# EAGLE design Humus_ethernet_dip_v4 (EAGLE 7.6.0)
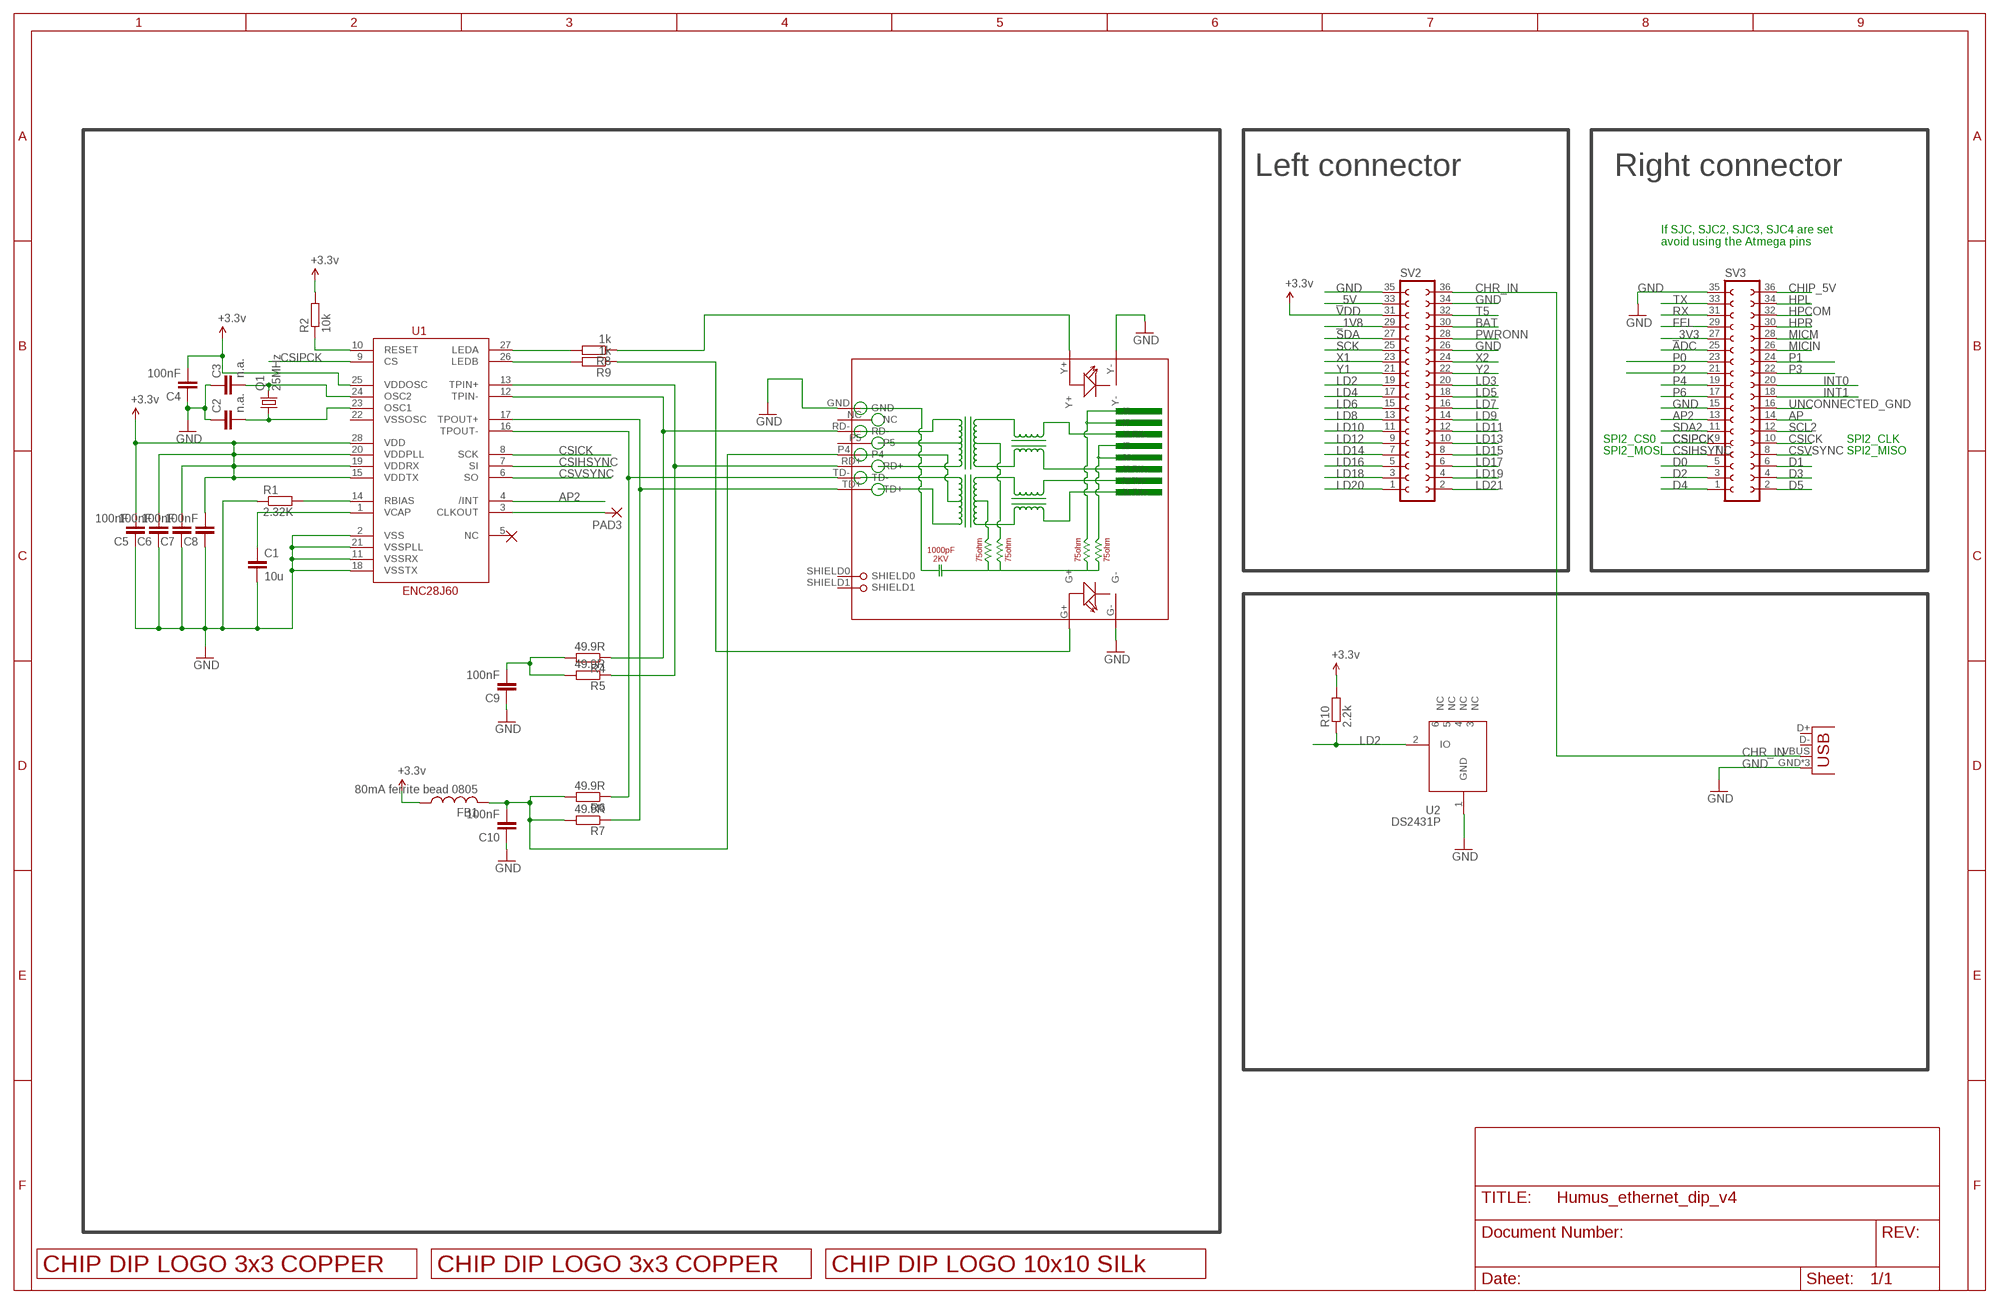
[diagram p0: schematic, sheet 1]

## Parts
C1  10u  C-EUC0805  [C0805]
C2  n.a.  C-EUC0805  [C0805]
C3  n.a.  C-EUC0805  [C0805]
C4  100nF  C-EUC0805  [C0805]
C5  100nF  C-EUC0805  [C0805]
C6  100nF  C-EUC0805  [C0805]
C7  100nF  C-EUC0805  [C0805]
C8  100nF  C-EUC0805  [C0805]
C9  100nF  C-EUC0805  [C0805]
C10  100nF  C-EUC0805  [C0805]
FB1  80mA ferrite bead 0805  FERRITE-BEADB  [0805]
PAD3  WIREPADSMD1,27-254  [SMD1,27-2,54]
Q1  25MHz  CRYSTALSM49  [SM49]
R1  2.32K  R-EU_R0805  [R0805]
R2  10k  R-EU_R0805  [R0805]
R4  49.9R  R-EU_R0805  [R0805]
R5  49.9R  R-EU_R0805  [R0805]
R6  49.9R  R-EU_R0805  [R0805]
R7  49.9R  R-EU_R0805  [R0805]
R8  1k  R-EU_R0805  [R0805]
R9  1k  R-EU_R0805  [R0805]
R10  2.2k  R-EU_R0805  [R0805]
RJ1  HR911105A  [HR911105A]
SV2  FE18-2  [FE18-2]
SV3  FE18-2  [FE18-2]
U1  ENC28J60SS  ENC28J60  [SSOP28DB]
U2  DS2431P  [TSOC6]
U$1  LOGO_10X10_SILK  [LOGO2_10X10_SILK]
U$2  LOGO_3X3_COPPER  [LOGO_3X3_COPPER]
U$4  LOGO_3X3_COPPER  [LOGO_3X3_COPPER]
USB  USBUSB-MICROB-SMT-DIP  [USB-MICROB-SMT-DIP]

## Nets
_1V8: SV2.29
_3V3: SV3.27
_5V: SV2.33
ADC: SV3.25
AP: SV3.14
AP2: SV3.13 U1.4(/INT)
BAT: SV2.30
CHIP_5V: SV3.36
CHR_IN: SV2.36 USB.VBUS
CSICK: SV3.10 U1.8(SCK)
CSIHSYNC: SV3.7 U1.7(SI)
CSIPCK: SV3.9 U1.9(CS)
CSVSYNC: SV3.8 U1.6(SO)
CT: C10.2 FB1.2 R6.2 R7.2 RJ1.P4
D0: SV3.5
D1: SV3.6
D2: SV3.3
D3: SV3.4
D4: SV3.1
D5: SV3.2
FEL: SV3.29
GND: C1.2 C2.1 C3.1 C4.1 C5.1 C6.1 C7.1 C8.1 C9.1 C10.1 R1.1 RJ1.G- RJ1.GND RJ1.Y- SV2.26 SV2.34 SV2.35 SV3.15 SV3.35 U1.2(VSS) U1.11(VSSRX) U1.18(VSSTX) U1.21(VSSPLL) U2.1(GND) USB.GND USB.MT1(GND) USB.MT2(GND)
HPCOM: SV3.32
HPL: SV3.34
HPR: SV3.30
INT0: SV3.20
INT1: SV3.18
LD2: R10.1 SV2.19 U2.2(IO)
LD3: SV2.20
LD4: SV2.17
LD5: SV2.18
LD6: SV2.15
LD7: SV2.16
LD8: SV2.13
LD9: SV2.14
LD10: SV2.11
LD11: SV2.12
LD12: SV2.9
LD13: SV2.10
LD14: SV2.7
LD15: SV2.8
LD16: SV2.5
LD17: SV2.6
LD18: SV2.3
LD19: SV2.4
LD20: SV2.1
LD21: SV2.2
MICIN: SV3.26
MICM: SV3.28
N$1: C1.1 U1.1(VCAP)
N$2: R2.1 U1.10(RESET)
N$3: R1.2 U1.14(RBIAS)
N$6: C3.2 Q1.2 U1.24(OSC2)
N$7: C2.2 Q1.1 U1.23(OSC1)
N$10: R8.1 RJ1.Y+
N$11: R9.1 RJ1.G+
N$13: PAD3.1(P) U1.3(CLKOUT)
N$14: C9.2 R4.2 R5.2
N$15: R8.2 U1.27(LEDA)
N$16: R9.2 U1.26(LEDB)
P0: SV3.23
P1: SV3.24
P2: SV3.21
P3: SV3.22
P4: SV3.19
P6: SV3.17
PWRONN: SV2.28
RD+: R5.1 RJ1.RD+ U1.13(TPIN+)
RD-: R4.1 RJ1.RD- U1.12(TPIN-)
RX: SV3.31
SCK: SV2.25
SCL2: SV3.12
SDA: SV2.27
SDA2: SV3.11
T5: SV2.32
TD+: R7.1 RJ1.TD+ U1.17(TPOUT+)
TD-: R6.1 RJ1.TD- U1.16(TPOUT-)
TX: SV3.33
UNCONNECTED_GND: SV3.16
VDD: C4.2 C5.2 C6.2 C7.2 C8.2 FB1.1 R2.2 R10.2 SV2.31 U1.15(VDDTX) U1.19(VDDRX) U1.20(VDDPLL) U1.25(VDDOSC) U1.28(VDD) ; supply symbol labelled +3.3v
X1: SV2.23
X2: SV2.24
Y1: SV2.21
Y2: SV2.22
Unconnected: RJ1.NC RJ1.P5 RJ1.SHIELD0 RJ1.SHIELD1 U1.5(NC) U1.22(VSSOSC) U2.3(NC) U2.4(NC) U2.5(NC) U2.6(NC) USB.D+ USB.D-

## Notes on the sheet
- Left connector | Right connector
- If SJC, SJC2, SJC3, SJC4 are set 
  avoid using the Atmega pins
- SPI2_CS0 | SPI2_CLK
- SPI2_MOSI | SPI2_MISO

## Library data of the parts
C1-C10 = rcl:C-EU: CAPACITOR, European symbol
FB1 = m-pad-2.1:FERRITE-BEAD: Ferrite beads in various packages
PAD3 = wirepad:WIREPAD: Wire PAD connect wire on PCB
Q1 = adafruit:CRYSTAL: CRYSTAL; OC_FARNELL: unknown; OC_NEWARK: unknown
R1 R2 R4-R10 = rcl:R-EU_: RESISTOR, European symbol
RJ1 = CONNECTER:HR911105A
SV2 SV3 = con-lsta:FE18-2: FEMALE HEADER; OC_FARNELL: unknown; OC_NEWARK: unknown
U1 = SparkFun-DigitalIC:ENC28J60: Microchip SPI 10Base ethernet IC
U2 = JKW_CHIP:DS2431: 1024-Bit EEPROM This chip provides a 4x256 Bit EEPROM, which can be programmed@5V. Write protection and OTP emulation are available, too. Author: Jan Kandziora <jjj@gmx.de>; DESCRIPTION: IC, 1024-Bit, 1-Wire EEPROM, TSOC6; FOOTPRINT: TSOC6; LINK: http://www.digikey.com/product-detail/en/DS2431P%2BT%26R/DS2431P%2BT%26RCT-ND/3647900; MFG: DIGIKEY; MFG_PN: DS2431P+T&RCT-ND; PART_TYPE: IC; PRICE: 0.98; VENDOR: MAXIM; VENDOR_PART_NUMBER: DS2431P+T&R
U$1 = JKW_CHIP:LOGO_10X10_SILK
U$2 U$4 = logo:LOGO_3X3_COPPER
USB = Spark:USB

## Board
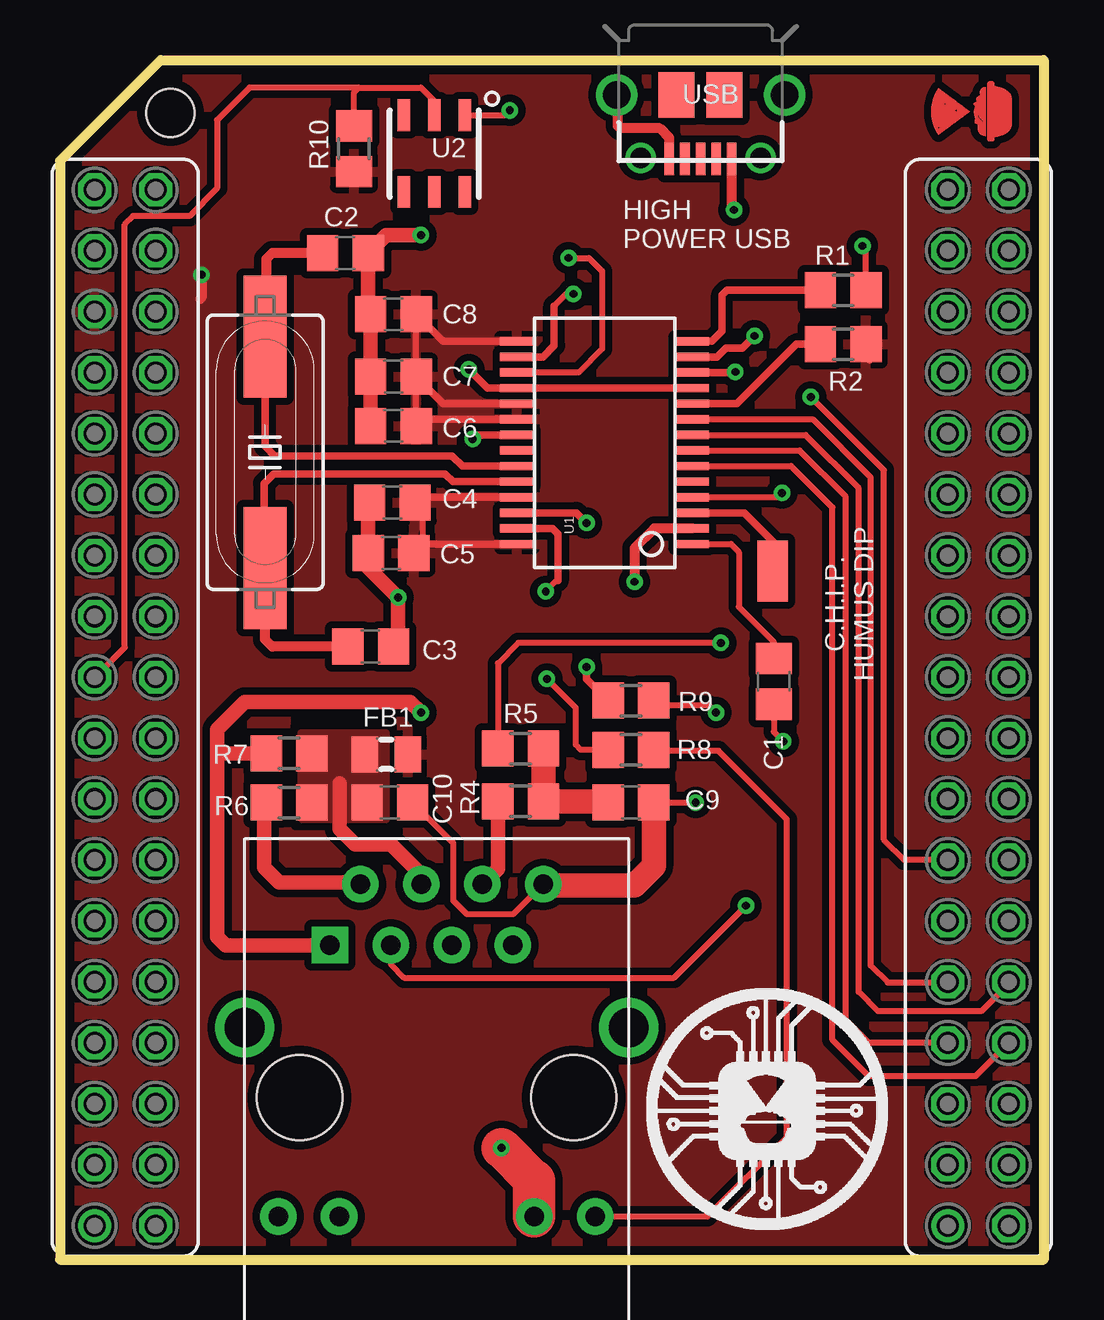
[diagram p1: board, top side]
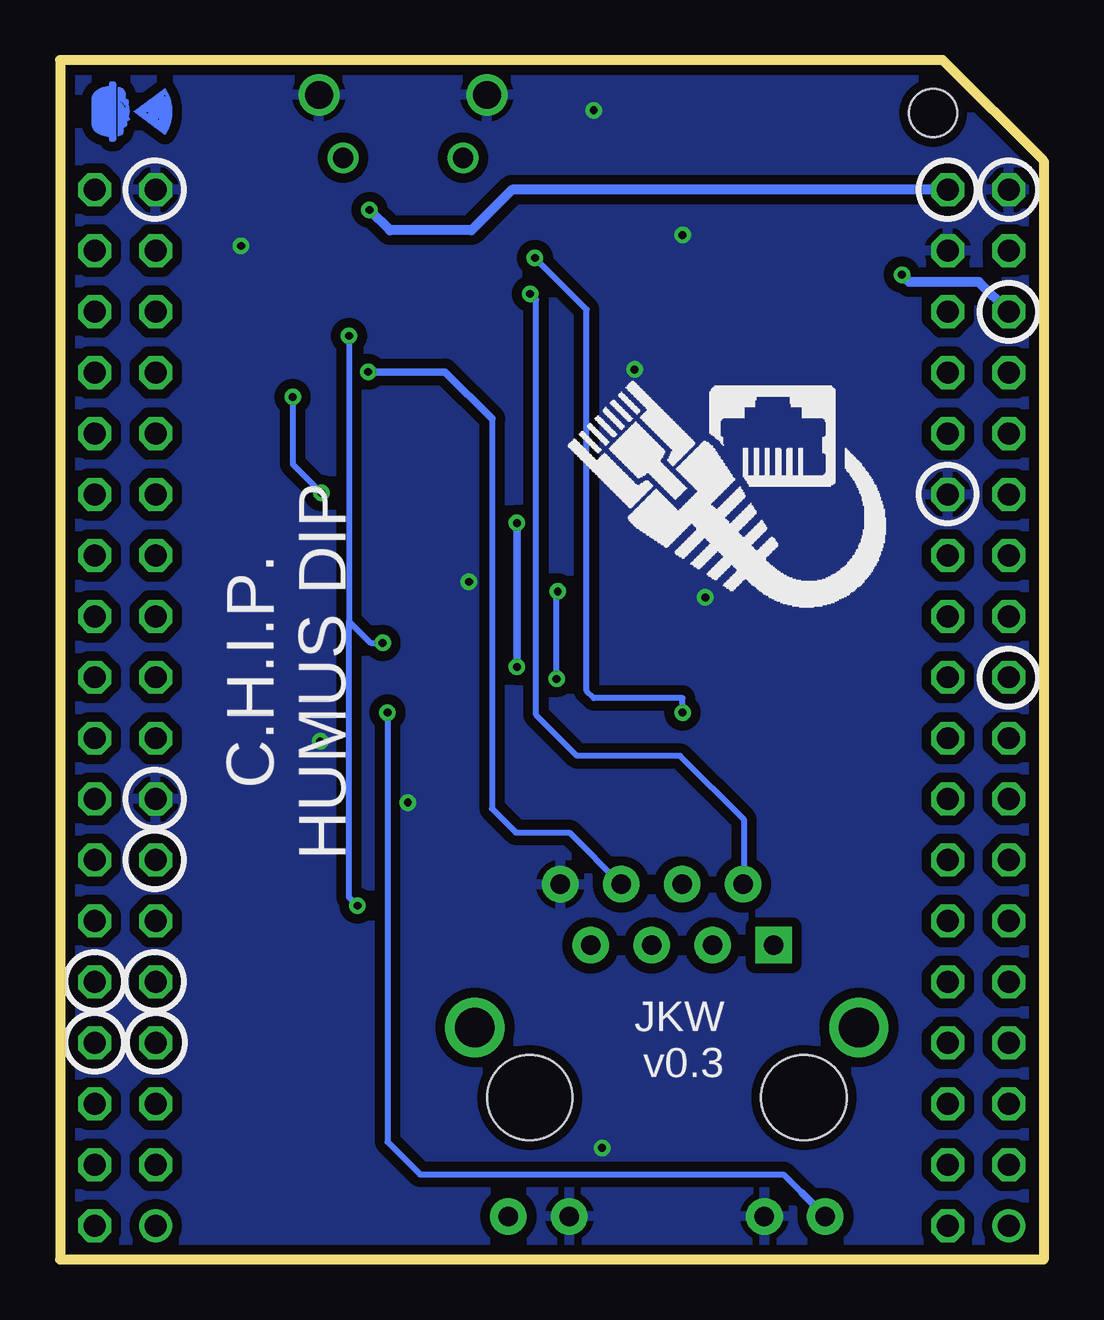
[diagram p2: board, bottom side, seen from below]

Size 41 x 50 mm. Coordinates in mm from the lower left corner, seen from the top.
Outline: 0,45.8 4.2,50 41,50 41,0 0,0 0,45.8
Copper layers (1*16): Top 0.0356mm / dielectric 1.5011mm / Bottom 0.0356mm
Design rules "LaenPCBOrder": minimum track width 6mil, minimum drill 13mil, track to track 6mil, track to pad 6mil, pad to pad 6mil, via to via 6mil, smd to smd 6mil, copper to edge 15mil, drill to drill 6mil, minimum pad ring 7mil, minimum via ring 7mil, stop-mask expansion 3mil, vias tented up to drill 0mil, thermal gap 10mil
Holes 2 mm at 4.6,47.8

### Footprints (pad centres in the part's own frame; a part is rotated, then mirrored left to right if it is on the bottom)
C0805 = smd 1.3 x 1.5: 1 -0.95,0; 2 0.95,0
0805 = smd 1.1 x 1.5: 1 -0.9,0; 2 0.9,0
SMD1,27-2,54 = smd 1.27 x 2.54: 1 0,0
SM49 = smd 5.08 x 1.778: 1 -4.826,0; 2 4.826,0
R0805 = smd 1.3 x 1.5: 1 -0.95,0; 2 0.95,0
HR911105A = drill 0.813 pad 1.524: G+ 4.953,-6.604; G- 4.953,-4.064; GND -8.89,4.445; NC -6.35,3.175; P4 -8.89,-0.635; P5 -6.35,0.635; RD+ -6.35,-1.905; RD- -8.89,1.905; TD- -8.89,-3.175; Y+ 4.953,6.604; Y- 4.953,4.064 | drill 1.651 pad 2.159: SHIELD0 -2.921,8.001; SHIELD1 -2.921,-8.001 | drill 0.813 pad 1.524 square: TD+ -6.35,-4.445 | hole 3.556: 0,-5.715; 0,5.715
FE18-2 = drill 0.914: 1 -21.59,1.27 | drill 0.914 octagon: 2 -21.59,-1.27; 3 -19.05,1.27; 4 -19.05,-1.27; 5 -16.51,1.27; 6 -16.51,-1.27; 7 -13.97,1.27; 8 -13.97,-1.27; 9 -11.43,1.27; 10 -11.43,-1.27; 11 -8.89,1.27; 12 -8.89,-1.27; 13 -6.35,1.27; 14 -6.35,-1.27; 15 -3.81,1.27; 16 -3.81,-1.27; 17 -1.27,1.27; 18 -1.27,-1.27; 19 1.27,1.27; 20 1.27,-1.27; 21 3.81,1.27; 22 3.81,-1.27; 23 6.35,1.27; 24 6.35,-1.27; 25 8.89,1.27; 26 8.89,-1.27; 27 11.43,1.27; 28 11.43,-1.27; 29 13.97,1.27; 30 13.97,-1.27; 31 16.51,1.27; 32 16.51,-1.27; 33 19.05,1.27; 34 19.05,-1.27; 35 21.59,1.27; 36 21.59,-1.27
SSOP28DB = smd 0.348 x 1.397: 1 -4.225,-3.656; 2 -3.575,-3.656; 3 -2.925,-3.656; 4 -2.275,-3.656; 5 -1.625,-3.656; 6 -0.975,-3.656; 7 -0.325,-3.656; 8 0.325,-3.656; 9 0.975,-3.656; 10 1.625,-3.656; 11 2.275,-3.656; 12 2.925,-3.656; 13 3.575,-3.656; 14 4.225,-3.656; 15 4.225,3.656; 16 3.575,3.656; 17 2.925,3.656; 18 2.275,3.656; 19 1.625,3.656; 20 0.975,3.656; 21 0.325,3.656; 22 -0.325,3.656; 23 -0.975,3.656; 24 -1.625,3.656; 25 -2.275,3.656; 26 -2.925,3.656; 27 -3.575,3.656; 28 -4.225,3.656
TSOC6 = smd 0.53 x 1.33: 1 -1.27,-1.6; 2 0,-1.6; 3 1.27,-1.6; 4 1.27,1.6; 5 0,1.6; 6 -1.27,1.6
USB-MICROB-SMT-DIP = smd 0.4 x 1.35: D+ 0,2.675; D- -0.65,2.675; GND 1.3,2.675; ID 0.65,2.675; VBUS -1.3,2.675 | drill 1.15 pad 1.7: MT1 -3.5,0; MT2 3.5,0 | drill 0.85 pad 1.25: MT3 -2.5,2.625; MT4 2.5,2.625 | smd 1.5 x 1.9: P$1 -1,0; P$2 1,0.01

### Placement (x,y rotation side)
C1  29.75,24.1 270 top
C2  11.9,41.95 180 top
C3  12.95,25.55 180 top
C4  13.85,31.55 0 top
C5  13.8,29.45 0 top
C6  13.9,34.75 0 top
C7  13.9,36.8 0 top
C8  13.9,39.4 0 top
C9  23.8,19.05 180 top
C10  13.75,19.05 180 top
FB1  13.6,21.05 180 top
PAD3  29.7,28.7 0 top
Q1  8.55,33.65 270 top
R1  32.65,40.4 180 top
R2  32.65,38.15 0 top
R4  19.2,19.1 0 top
R5  19.2,21.3 0 top
R6  9.55,19.05 0 top
R7  9.55,21.1 0 top
R8  23.8,21.25 180 top
R9  23.8,23.3 180 top
R10  12.25,46.3 270 top
RJ1  15.7,6.75 270 top
SV2  2.72,23 90 top
SV3  38.28,23 90 top
U1  22.7,34.05 90 top
U2  15.6,46.1 180 top
U$1  24.45,1.25 0 top
U$2  38,47.85 90 top
U$4  38,47.85 270 bottom
USB  26.7,48.55 180 top

### Tracks (layer width: path | path; a pad name or v marks a point on that pad's centre or on a via)
AP2  (via drill 0.33)
  Top 0.254: U1.4 29.93,31.77 v30.1,31.95 | SV3.13 35.2,16.65 34.35,17.5 34.35,32.9 v31.3,35.95
  Bottom 0.254: v31.3,35.95 31.3,33.15 v30.1,31.95
CHR_IN  (via drill 0.33)
  Top 0.254: v28.1,43.75 28,43.85
  Top 0.406: 28,43.85 USB.VBUS
  Bottom 0.406: SV2.36 22.16,44.59 23.85,42.9 27.25,42.9 v28.1,43.75
CSICK
  Top 0.254: U1.8 31.07,34.38 33.3,32.15 33.3,11.15 34.1,10.35 38.4,10.35 39.55,11.5 SV3.10
CSIHSYNC
  Top 0.254: U1.7 30.82,33.73 32.75,31.8 32.75,10 33.7,9.05 36.99,9.05 SV3.7 36.98,9
CSIPCK
  Top 0.254: U1.9 31.38,35.02 33.8,32.6 33.8,12.25 34.5,11.55 36.99,11.55 SV3.9
CSVSYNC
  Top 0.254: U1.6 30.48,33.08 32.2,31.35 32.2,9.15 33.7,7.65 38.17,7.65 SV3.8
CT
  Top 0.254: C10.2 13,19.2
  Top 0.61: RJ1.P4 15.06,16.04 13.8,17.3 12.3,17.3 11.65,17.95 11.65,19.85
  pour Top (no thermals): 10.1,18.35 13.6,18.35 13.6,21.95 10.05,21.95 10.05,18.4
GND  (via drill 0.33)
  Top 0.254: C9.1 v26.5,19.05 | v15.05,42.7 15.18,42.83 | R1.1 33.6,42.1 v33.45,42.25 | C1.2 29.75,22 v30.15,21.6 | 23.25,48.5 USB.MT2 | 14.7,18.95 C10.1 16.4,17.35 16.4,14.95 16.95,14.4 18.91,14.4 RJ1.GND | U2.1 18.55,47.7 v18.75,47.9
  Top 0.305: U1.21 17.38,34.38 v17.2,34.2 | 20.18,15.6 RJ1.GND | U1.11 U1.18 17.82,36.33 v17.05,37.1
  Top 0.406: U1.2 24.77,30.48 23.95,29.65 v23.95,28.25 | USB.GND 25.4,46.75 25,47.15 23.35,47.15 23.25,47.25 23.25,48.5
  Top 0.61: C6.1 C7.1 C8.1 12.85,39.5 C2.1 13.6,42.7 v15.05,42.7 | C3.1 14.1,25.75 v14.1,27.6 12.85,28.85 C5.1 12.85,31.5 C4.1
  Top 1.016: C9.1 24.75,16.4 23.95,15.6 20.18,15.6
  Top 1.676: 19.76,3.29 v18.4,4.65
  Top 1.778: RJ1.Y- 19.76,3.29
  pour Bottom (isolate 0.406): 4.2,50 41.05,50 41.05,0.25 0.02,0.25 0,45.8
LD2
  Top 0.254: SV2.19 2.7,25.52 2.7,43.15 3.05,43.5 5.4,43.5 6.55,44.65 6.55,47.5 7.9,48.85 12.45,48.85 | 12.45,48.85 15.05,48.85 15.6,48.3 U2.2 | R10.1 12.25,48.65 12.45,48.85
N$1
  Top 0.254: U1.1 27.98,29.82 28.3,29.5 28.3,27.2 29.75,25.75 C1.1
N$2
  Top 0.305: U1.10 28.23,35.67 30.7,38.15 R2.1
N$3
  Top 0.305: U1.14 27.18,38.27 27.6,38.7 27.6,40.2 27.8,40.4 R1.2
N$6
  Top 0.254: 8.5,28.87 Q1.2
  Top 0.305: U1.24 16.38,32.42 16.05,32.75 8.9,32.75 8.5,32.35 8.5,28.87
  Top 0.406: C3.2 8.85,25.55 8.55,25.85 Q1.2
N$7
  Top 0.254: 8.6,38.53 Q1.1
  Top 0.305: U1.23 16.77,33.08 16.35,33.5 8.95,33.5 8.55,33.9 Q1.1
  Top 0.406: C2.2 8.85,41.95 8.6,41.7 8.6,38.53
N$10
  Top 0.254: RJ1.Y+ 27,1.8 30.3,5.1 30.3,18.35 27.45,21.2 24.8,21.2 R8.1
N$11  (via drill 0.33)
  Top 0.254: v27.35,22.8 27.05,23.1 24.95,23.1 R9.1
  Bottom 0.254: v27.35,22.8 27.35,4.9 26,3.55 10.85,3.55 10.07,2.78
  Bottom 0.305: RJ1.G+ 10.07,2.78
N$13
  Top 0.254: 29.8,29.85 29.8,28.8 PAD3.1
  Top 0.305: U1.3 28.52,31.12 29.8,29.85
N$14
  Top 0.305: 22.8,19.1 C9.2
  Top 1.016: R5.2 R4.2 22.8,19.1
N$15  (via drill 0.33)
  Top 0.254: R8.2 21.7,21.25 21.5,21.45 21.5,23 v20.3,24.2 | 20.75,28.3 20.7,28.3 v20.25,27.85
  Top 0.305: U1.27 20.52,30.48 20.75,30.25 20.75,28.3
  Bottom 0.254: v20.3,24.2 20.3,27.8 v20.25,27.85
N$16  (via drill 0.33)
  Top 0.254: 22.75,23.4 R9.2
  Top 0.305: U1.26 21.52,31.12 v21.95,30.7 | v21.95,24.7 21.95,24.2 R9.2
  Bottom 0.305: v21.95,30.7 v21.95,24.7
RD+  (via drill 0.33)
  Top 0.254: 18.15,21.4 R5.1 18.25,24.85 19.1,25.7 v27.55,25.7 | RJ1.RD+ 13.79,12.3 14.35,11.75 25.6,11.75 v28.6,14.75
  Top 0.305: U1.13 27.38,37.62 27.75,38 28.45,38 v28.95,38.5
  Bottom 0.254: v28.95,38.5 28.95,26.6 | 28.95,26.6 28.05,25.7 v27.55,25.7 | 28.95,26.6 28.95,15.1 v28.6,14.75
RD-  (via drill 0.33)
  Top 0.254: 28.12,36.98 v28.15,37
  Top 0.305: U1.12 28.12,36.98
  Top 0.61: R4.1 18.25,16.29 RJ1.RD-
  Bottom 0.254: RJ1.RD- 19.77,17.8 22,17.8 23,18.8 23,35.05
  Bottom 0.305: v28.15,37 24.95,37 23,35.05
TD+  (via drill 0.33)
  Top 0.254: v21.2,41.75 22.05,41.75 22.6,41.2 22.6,37.95 21.62,36.98 U1.17
  Top 0.61: RJ1.TD+ 6.9,13.1 6.55,13.45 6.55,21.25 | 6.55,21.25 6.55,22.1 7.7,23.25 14.6,23.25 v15.05,22.8 | R7.1 6.7,21.1 6.55,21.25
  Bottom 0.254: v21.2,41.75 19.05,39.6 19.05,23.7 18.75,23.4 15.05,23.4 v15.05,22.8
TD-  (via drill 0.33)
  Top 0.254: v21.4,40.25 21.1,40.25 20.6,39.75
  Top 0.305: U1.16 20.12,37.62 20.6,38.1 20.6,39.75
  Top 0.61: 12.53,15.72 9.12,15.72 8.5,16.35 8.5,18.95 R6.1
  Top 0.813: RJ1.TD- 12.53,15.72
  Bottom 0.254: RJ1.TD- 12.5,15.66 12.5,18.35 15.15,21 19.45,21 21.15,22.7 21.15,40 v21.4,40.25
VDD  (via drill 0.33)
  Top 0.254: C5.2 15.12,29.82 15.12,31.23 C4.2 15.03,31.77 | C6.2 15.05,34.95 | 14.9,39.45 C8.2 C7.2 14.85,35.15 15.05,34.95 | 33.75,37.45 33.6,37.6 | 15.12,35.02 15.05,34.95
  Top 0.305: U1.28 15.12,29.82 | U1.25 15.03,31.77 | 15.12,35.02 U1.20 | U1.19 15.97,35.67 C7.2 | U1.15 15.97,38.27 C8.2
  Top 0.406: 33.6,37.6 R2.2 | v5.9,41.05 5.9,40.1 5.85,40.05
  Bottom 0.406: SV2.31 2.69,40.75 5.6,40.75 v5.9,41.05
  pour Top (isolate 0.305, rank 2): -0.07,0.25 40.88,0.25 41.01,10.57 41.01,50.01 5,50 4.2,50.01 0,45.8 0,10.47

### Text on the board
Unrouted: ordered 2016/06/20
bPlace: JKW / v0.3
tNames: HIGH / POWER USB | C.H.I.P. / HUMUS DIP
bNames: C.H.I.P. / HUMUS DIP